# Altium schematic sheet 3_DISPLAY.SchDoc
size A4; SheetNumber: 4; SheetTotal: 4
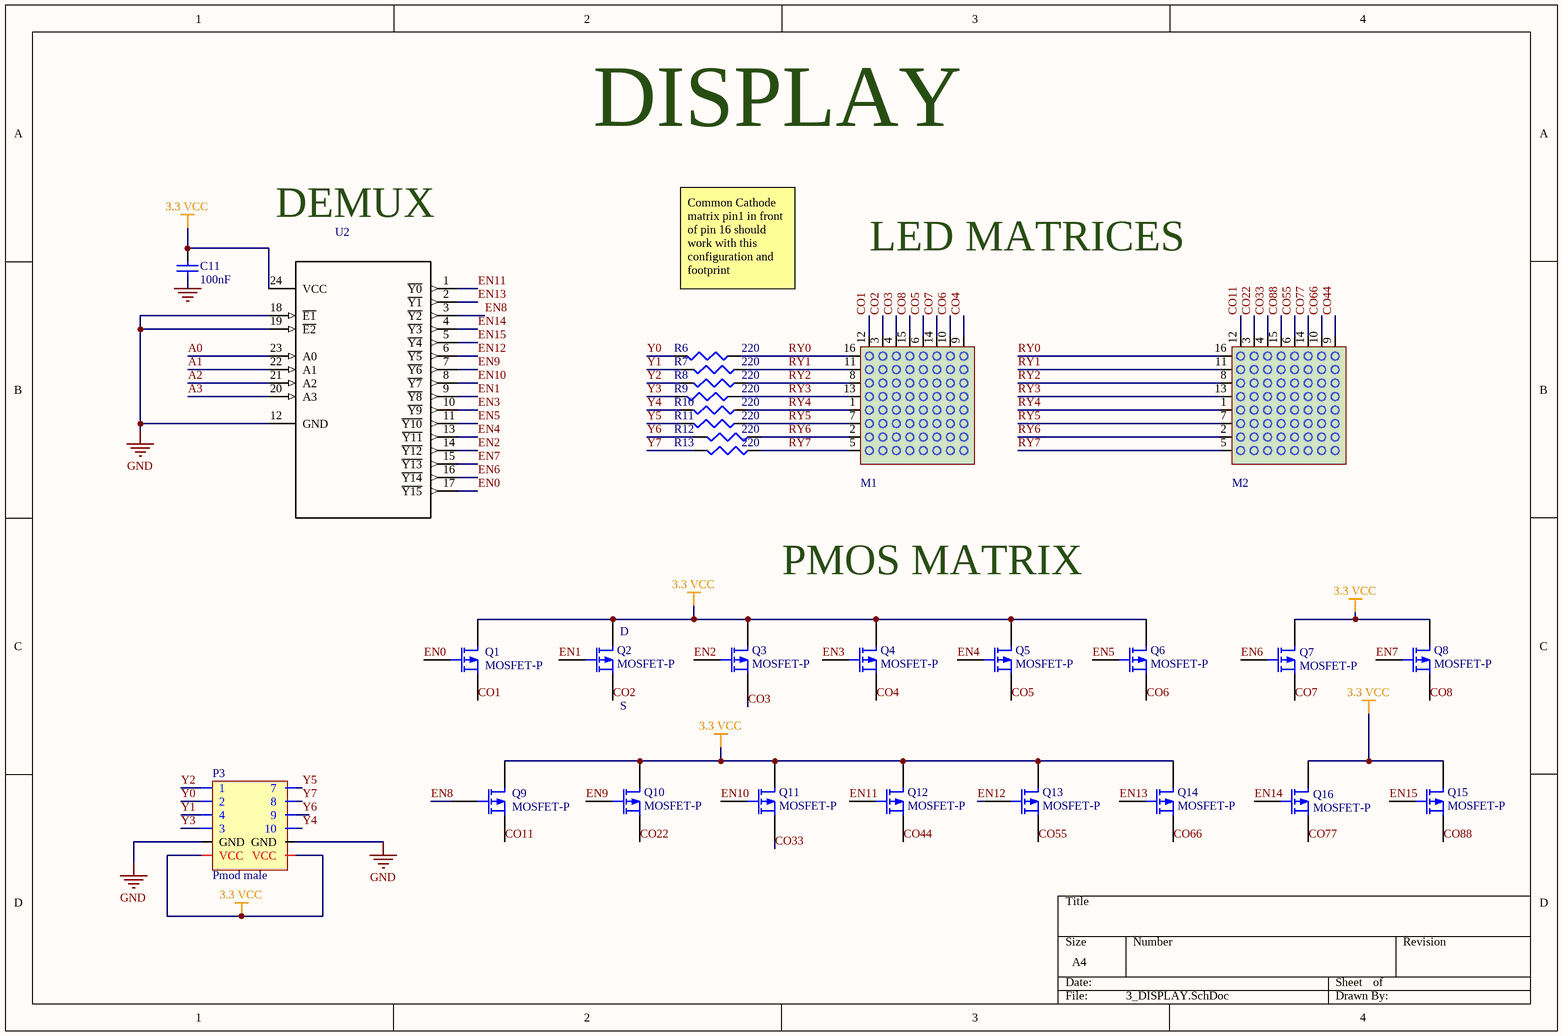
[diagram p0: 3_DISPLAY.SchDoc]

## Parts
C11  value 100nF  [1608[0603]]  (hidden comment: Cap Semi)
M1  matrix8X8  [Matrix Led]  (value not drawn)
M2  matrix8X8  [Matrix Led]  (value not drawn)
P3  Pmod male  [901220766]
Q1  MOSFET-P  [BSS84PWH6327XTSA1]
Q2  MOSFET-P  [BSS84PWH6327XTSA1]
Q3  MOSFET-P  [BSS84PWH6327XTSA1]
Q4  MOSFET-P  [BSS84PWH6327XTSA1]
Q5  MOSFET-P  [BSS84PWH6327XTSA1]
Q6  MOSFET-P  [BSS84PWH6327XTSA1]
Q7  MOSFET-P  [BSS84PWH6327XTSA1]
Q8  MOSFET-P  [BSS84PWH6327XTSA1]
Q9  MOSFET-P  [BSS84PWH6327XTSA1]
Q10  MOSFET-P  [BSS84PWH6327XTSA1]
Q11  MOSFET-P  [BSS84PWH6327XTSA1]
Q12  MOSFET-P  [BSS84PWH6327XTSA1]
Q13  MOSFET-P  [BSS84PWH6327XTSA1]
Q14  MOSFET-P  [BSS84PWH6327XTSA1]
Q15  MOSFET-P  [BSS84PWH6327XTSA1]
Q16  MOSFET-P  [BSS84PWH6327XTSA1]
R6  value 220  [Resistor 0805]  (hidden comment: 270R)
R7  value 220  [Resistor 0805]  (hidden comment: 270R)
R8  value 220  [Resistor 0805]  (hidden comment: 270R)
R9  value 220  [Resistor 0805]  (hidden comment: 270R)
R10  value 220  [Resistor 0805]  (hidden comment: 270R)
R11  value 220  [Resistor 0805]  (hidden comment: 270R)
R12  value 220  [Resistor 0805]  (hidden comment: 270R)
R13  value 220  [Resistor 0805]  (hidden comment: 270R)
U2  CD74HC154M  [*SOIC127P1030X265-24N]  (value not drawn)

## Nets
3.3 VCC: C11.1 P3.6(VCC) P3.12(VCC) Q1.3(D) Q2.3(D) Q3.3(D) Q4.3(D) Q5.3(D) Q6.3(D) Q7.3(D) Q8.3(D) Q9.3(D) Q10.3(D) Q11.3(D) Q12.3(D) Q13.3(D) Q14.3(D) Q15.3(D) Q16.3(D) U2.24(VCC)
GND: C11.2 P3.5(GND) P3.11(GND) U2.12(GND) U2.18(~{E1}) U2.19(~{E2})
A0: U2.23(A0)
A1: U2.22(A1)
A2: U2.21(A2)
A3: U2.20(A3)
CO1: M1.12 Q1.2(S)
CO2: M1.3 Q2.2(S)
CO3: M1.4 Q3.2(S)
CO4: M1.9 Q4.2(S)
CO5: M1.6 Q5.2(S)
CO6: M1.10 Q6.2(S)
CO7: M1.14 Q7.2(S)
CO8: M1.15 Q8.2(S)
CO11: M2.12 Q9.2(S)
CO22: M2.3 Q10.2(S)
CO33: M2.4 Q11.2(S)
CO44: M2.9 Q12.2(S)
CO55: M2.6 Q13.2(S)
CO66: M2.10 Q14.2(S)
CO77: M2.14 Q16.2(S)
CO88: M2.15 Q15.2(S)
EN0: Q1.1(G) U2.17(~{Y15})
EN1: Q2.1(G) U2.9(~{Y8})
EN2: Q3.1(G) U2.14(~{Y12})
EN3: Q4.1(G) U2.10(~{Y9})
EN4: Q5.1(G) U2.13(~{Y11})
EN5: Q6.1(G) U2.11(~{Y10})
EN6: Q7.1(G) U2.16(~{Y14})
EN7: Q8.1(G) U2.15(~{Y13})
EN8: Q9.1(G) U2.3(~{Y2})
EN9: Q10.1(G) U2.7(~{Y6})
EN10: Q11.1(G) U2.8(~{Y7})
EN11: Q12.1(G) U2.1(~{Y0})
EN12: Q13.1(G) U2.6(~{Y5})
EN13: Q14.1(G) U2.2(~{Y1})
EN14: Q16.1(G) U2.4(~{Y3})
EN15: Q15.1(G) U2.5(~{Y4})
RY0: M1.16 M2.16 R6.1
RY1: M1.11 M2.11 R7.1
RY2: M1.8 M2.8 R8.1
RY3: M1.13 M2.13 R9.1
RY4: M1.1 M2.1 R10.1
RY5: M1.7 M2.7 R11.1
RY6: M1.2 M2.2 R12.1
RY7: M1.5 M2.5 R13.1
Y0: P3.2 R6.2
Y1: P3.4 R7.2
Y2: P3.1 R8.2
Y3: P3.3 R9.2
Y4: P3.10 R10.2
Y5: P3.7 R11.2
Y6: P3.9 R12.2
Y7: P3.8 R13.2

## Notes on the sheet
- DISPLAY
- DEMUX
- Common Cathode matrix pin1 in front of pin 16 should work with this configuration and footprint
- LED MATRICES
- PMOS MATRIX
- (near Q2) D
- (near Q2) S

## Library data of the parts
C11 = Cap Semi: Capacitor (Semiconductor SIM Model); Published: 8-Jun-2000; LatestRevisionDate: 29-May-2009; LatestRevisionNote: IPC-7351 Footprint Added.; PackageReference: C1206; Publisher: Altium Limited; PackageDescription: Chip Capacitor
P3 = Pmod male: p mod male 6 position 2 rows
Q1-Q16 = MOSFET-P: P-Channel MOSFET; Published: 8-Jun-2000; LatestRevisionDate: 17-Jul-2002; LatestRevisionNote: Re-released for DXP Platform.; PackageVersion: 1995/1996; PackageReference: E3; Publisher: Altium Limited; PackageDescription: TO, Flat Index; 3 In-Line, Axial Leads; Body Dia. 4.6mm; Lead Dia. 0.5 mm (max); Digi-KeyReference: BSS84PWH6327XTSA1CT-ND
R6-R13 = Res3: Resistor; Published: 8-Jun-2000; LatestRevisionDate: 29-May-2009; LatestRevisionNote: IPC-7351 Footprint Added.; PackageReference: J1-0603; Publisher: Altium Limited; PackageDescription: Chip Resistor
U2 = CD74HC154M: Decoder/Demultiplexer 1 x 4:16 24-SOIC; MF: Texas Instruments; MP: CD74HC154M; SnapEDA_Link: https://www.snapeda.com/parts/CD74HC154M/Texas%20Instruments/view-part/231174/?ref=snap; Availability: Unavailable; Package: SOIC-24 Texas Instruments; Price: None; Value: *; Digi-KeyReference: 296-24352-2-ND